# Altium schematic sheet RS232_Level_Shifter.SchDoc
size A
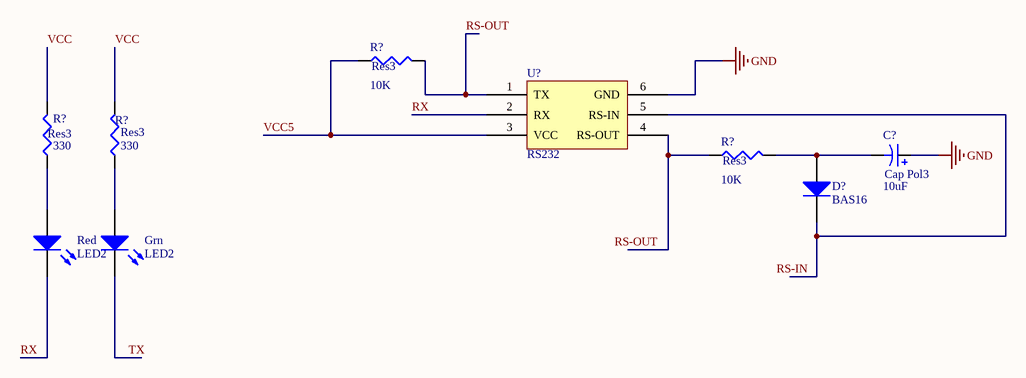
[diagram p0: RS232_Level_Shifter.SchDoc]

## Parts
(Parts that share a designator on the sheet are numbered #1, #2 ... from top to bottom, then left to right.)
C?  Cap Pol3  value 10uF  [C0805]
D?  BAS16  [SMC]
Grn  LED2  [3.2X1.6X1.1]
R?#1  Res3  value 10K  [J1-0603]
R?#2  Res3  value 10K  [J1-0603]
R?#3  Res3  value 330  [J1-0603]
R?#4  Res3  value 330  [J1-0603]
Red  LED2  [3.2X1.6X1.1]
U?  RS232  [rs232]

## Nets
GND: C?.1 U?.6(GND)
RS-OUT: R?#1.2 U?.1(TX)
RX: Red.2(K) U?.2(RX)
TX: Grn.2(K)
VCC: R?#3.2 R?#4.2
VCC5: R?#1.1 U?.3(VCC)
NetC?_2: C?.2 D?.1(A) R?#2.2
NetD?_2: D?.2(K) U?.5(RS-IN)
NetGrn_1: Grn.1(A) R?#4.1
NetR?#2_1: R?#2.1 U?.4(RS-OUT)
NetR?#3_1: R?#3.1 Red.1(A)

## Notes on the sheet
- Labels drawn without touching a wire or pin: RS-IN, RS-OUT

## Library data of the parts
C? = Cap Pol3: Polarized Capacitor (Surface Mount); Published: 8-Jun-2000; LatestRevisionDate: 29-May-2009; LatestRevisionNote: IPC-7351 Footprint Added.; PackageReference: C0805; Publisher: Altium Limited; PackageDescription: Chip Capacitor
D? = Diode: Default Diode; Published: 8-Jun-2000; LatestRevisionDate: 17-Jul-2002; LatestRevisionNote: Re-released for DXP Platform.; PackageVersion: Sep-1996; PackageReference: SMC; Publisher: Altium Limited; PackageDescription: DO-214-AB/SMC; 2 C-Bend Leads; Body 7.9 x 5.9 mm, inc. leads (LxW); Code_JEDEC: DO-214-AB
Grn Red = LED2: Typical RED, GREEN, YELLOW, AMBER GaAs LED; Published: 8-Jun-2000; LatestRevisionDate: 17-Jul-2002; LatestRevisionNote: Re-released for DXP Platform.; PackageVersion: Feb-2002; PackageReference: 3.2X1.6X1.1; Publisher: Altium Limited; PackageDescription: SM LED; 2 Flat Leads
R?#1-R?#4 = Res3: Resistor; Published: 8-Jun-2000; LatestRevisionDate: 29-May-2009; LatestRevisionNote: IPC-7351 Footprint Added.; PackageReference: J1-0603; Publisher: Altium Limited; PackageDescription: Chip Resistor